# EAGLE design Infinity Camera (EAGLE 6.4)
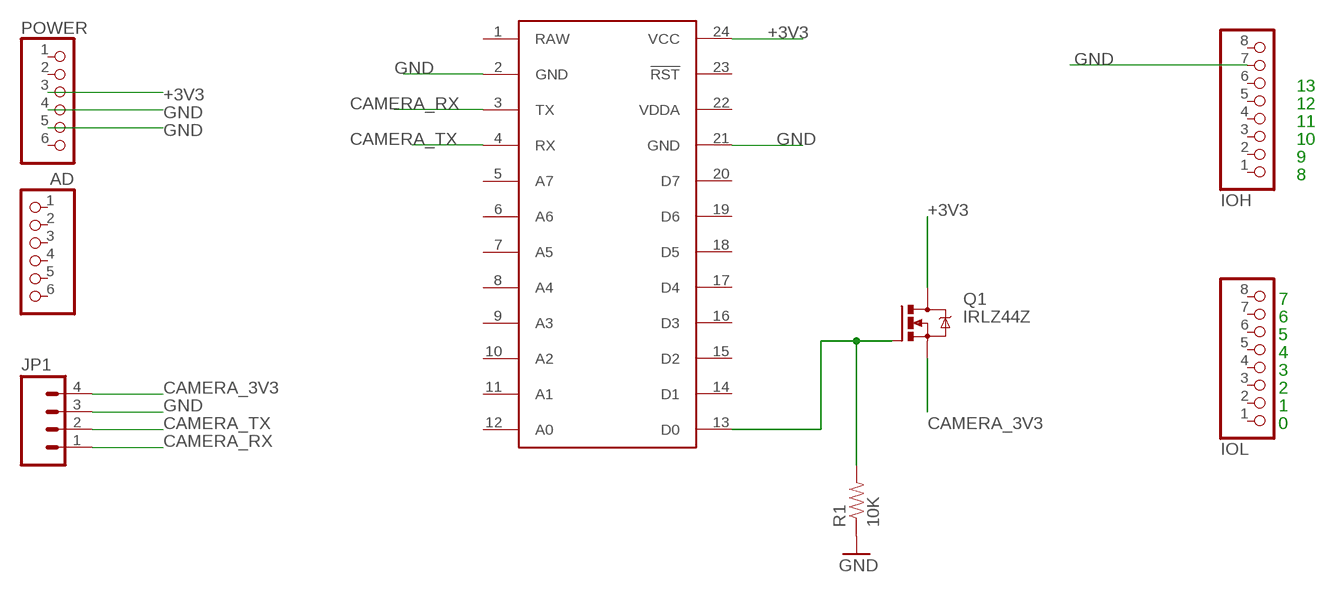
[diagram p0: schematic, sheet 1]

## Parts
AD  PINHD-1X6  [1X06]
IOH  PINHD-1X8  [1X08]
IOL  PINHD-1X8  [1X08]
JP1  M041.27MM  [1X04-1.27MM]
POWER  PINHD-1X6  [1X06]
Q1  IRLZ44Z  [TO220BH]
R1  10K  RESISTORPTH-1/4W  [AXIAL-0.4]
U$1  SPARK_CORECORE  [SPARK_CORE]

## Nets
+3V3: POWER.3 Q1.D U$1.24(VCC)
CAMERA_3V3: JP1.4 Q1.S
CAMERA_RX: JP1.1 U$1.3(TX)
CAMERA_TX: JP1.2 U$1.4(RX)
GND: IOH.7 JP1.3 POWER.4 POWER.5 R1.P$1 U$1.2(GND) U$1.21(GND)
N$1: Q1.G R1.P$2 U$1.13(D0)
Unconnected: AD.1 AD.2 AD.3 AD.4 AD.5 AD.6 IOH.1 IOH.2 IOH.3 IOH.4 IOH.5 IOH.6 IOH.8 IOL.1 IOL.2 IOL.3 IOL.4 IOL.5 IOL.6 IOL.7 IOL.8 POWER.1 POWER.2 POWER.6 U$1.5(A7) U$1.6(A6) U$1.7(A5) U$1.8(A4) U$1.9(A3) U$1.10(A2) U$1.11(A1) U$1.12(A0) U$1.14(D1) U$1.15(D2) U$1.16(D3) U$1.17(D4) U$1.18(D5) U$1.19(D6) U$1.20(D7) U$1.23(!RST)

## Notes on the sheet
- 13
- 12
- 11
- 10
- 9
- 8
- 7
- 6
- 5
- 4
- 3
- 2
- 1
- 0

## Power pins joined to a net without a drawn wire
RAW: U$1.1(RAW)
VDDA: U$1.22(VDDA)

## Library data of the parts
AD POWER = pinhead:PINHD-1X6: PIN HEADER
IOH IOL = pinhead:PINHD-1X8: PIN HEADER
JP1 = SparkFun-Connectors:M04: Header 4 Standard 4-pin 0.1" header. Use with straight break away headers (SKU : PRT-00116), right angle break away headers (PRT-00553), swiss pins (PRT-00743), machine pins (PRT-00117), and female headers (PRT-00115). Molex polarized connector foot print use with SKU : PRT-08231 with associated crimp pins and housings. 1MM SMD Version SKU: PRT-10208
Q1 = transistor-power:IRLZ44Z: N-Channel HEXFET® Power MOSFET Logic Level AUTOMOTIVE MOSFET Source: http://www.irf.com/product-info/datasheets/data/irlz44zpbf.pdf
R1 = SparkFun-Resistors:RESISTOR: Resistor Basic schematic elements and footprints for 0603, 1206, and PTH resistors.
U$1 = Spark:SPARK_CORE

## Net classes
0 default: width 0.152 mm, drill 0.305 mm, clearance 0.152 mm

## Board
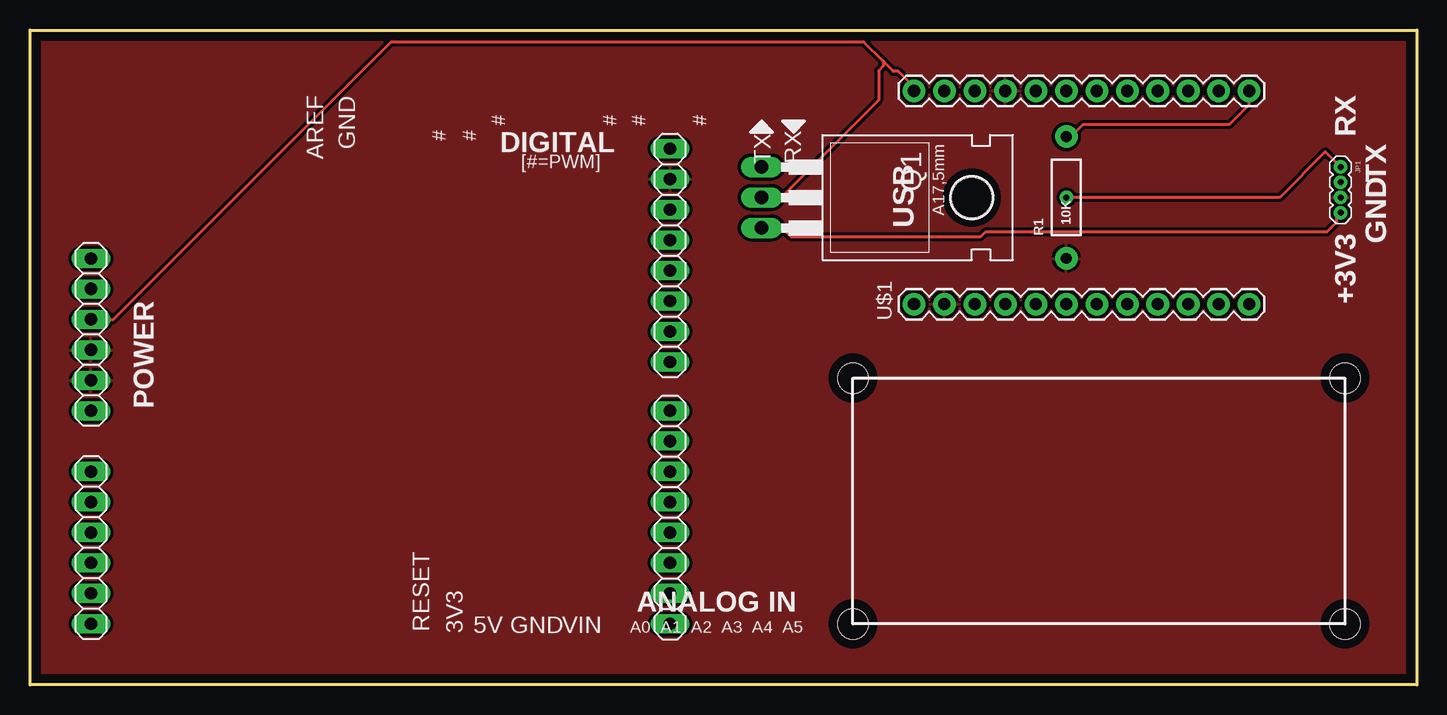
[diagram p1: board, top side]
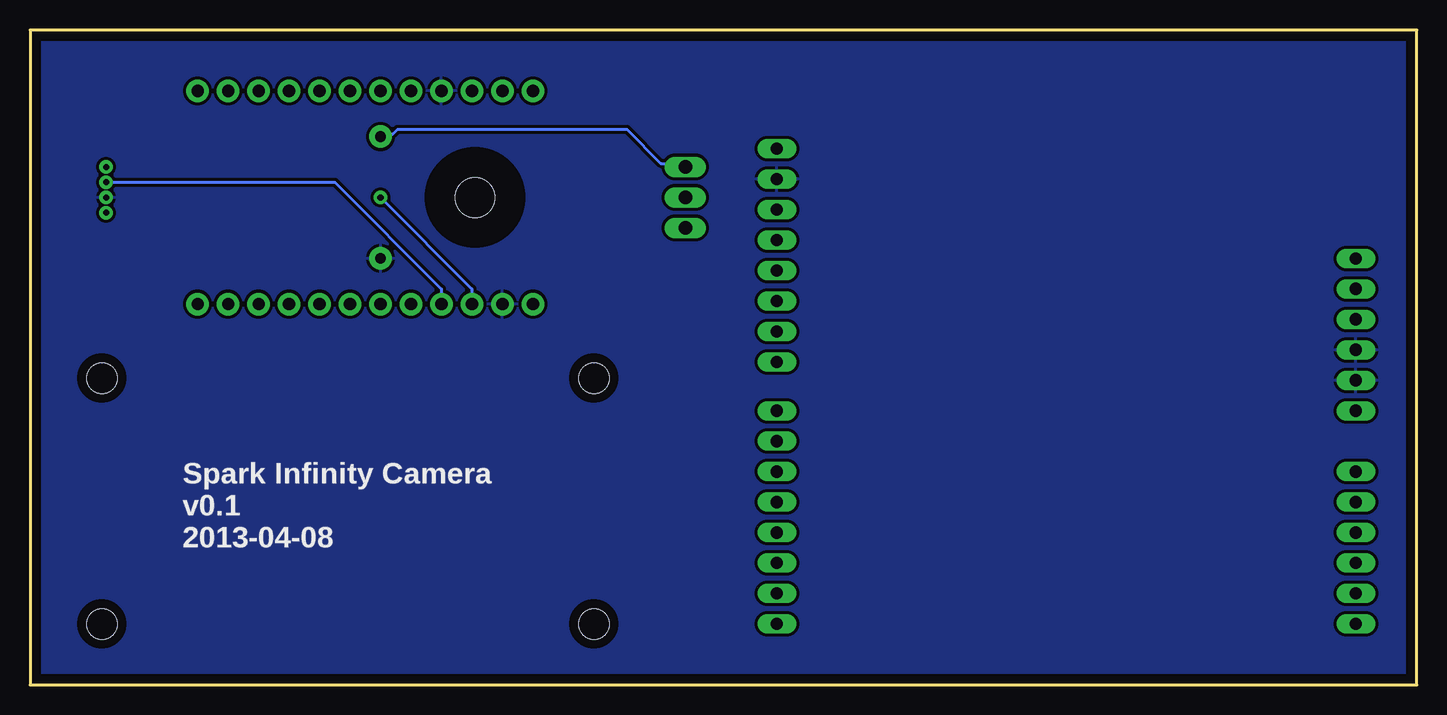
[diagram p2: board, bottom side, seen from below]

Size 115.57 x 54.61 mm. Coordinates in mm from the lower left corner, seen from the top.
Outline: 0,0 0,54.61 115.57,54.61 115.57,0 0,0
Copper layers (1*16): Top 0.035mm / dielectric 1.5mm / Bottom 0.035mm
Design rules "default *": minimum track width 10mil, minimum drill 12mil, track to track 10mil, track to pad 10mil, pad to pad 10mil, via to via 10mil, smd to smd 10mil, copper to edge 30mil, drill to drill 12mil, minimum pad ring 12mil, minimum via ring 12mil, stop-mask expansion 1mil, vias tented up to drill 0mil, thermal gap 10mil
Holes 2.54 mm at 109.58,5.08 68.58,5.08 68.58,25.58 109.58,25.58
vRestrict: area 47.9,10.3 to 48.5,10.8; area 50.4,10.2 to 50.9,11

### Footprints (pad centres in the part's own frame; a part is rotated, then mirrored left to right if it is on the bottom)
1X06 = drill 1.016 long: 1 -6.35,0; 2 -3.81,0; 3 -1.27,0; 4 1.27,0; 5 3.81,0; 6 6.35,0
1X08 = drill 1.016 long: 1 -8.89,0; 2 -6.35,0; 3 -3.81,0; 4 -1.27,0; 5 1.27,0; 6 3.81,0; 7 6.35,0; 8 8.89,0
1X04-1.27MM = drill 0.508 pad 1: 1 0,0; 2 1.27,0; 3 2.54,0; 4 3.81,0
TO220BH = drill 1.118 long: D 0,-6.35; G -2.54,-6.35; S 2.54,-6.35 | hole 3.302: 0,11.176
AXIAL-0.4 = drill 0.9 pad 1.88: P$1 -5.08,0; P$2 5.08,0
SPARK_CORE = drill 1.016 pad 1.88: 1 -8.89,13.97; 2 -8.89,11.43; 3 -8.89,8.89; 4 -8.89,6.35; 5 -8.89,3.81; 6 -8.89,1.27; 7 -8.89,-1.27; 8 -8.89,-3.81; 9 -8.89,-6.35; 10 -8.89,-8.89; 11 -8.89,-11.43; 12 -8.89,-13.97; 13 8.89,-13.97; 14 8.89,-11.43; 15 8.89,-8.89; 16 8.89,-6.35; 17 8.89,-3.81; 18 8.89,-1.27; 19 8.89,1.27; 20 8.89,3.81; 21 8.89,6.35; 22 8.89,8.89; 23 8.89,11.43; 24 8.89,13.97

### Placement (x,y rotation side)
AD  5.08,11.43 270 top
IOH  53.34,35.81 90 top
IOL  53.34,13.97 90 top
JP1  109.22,43.18 270 top
POWER  5.08,29.21 270 top
Q1  67.31,40.64 270 top
R1  86.36,40.64 90 top
U$1  87.63,40.64 90 top
U$2  [SPARK_LOGO]  7.62,5.08 0 top
U$3  [SPARK_LOGO]  74.93,38.1 0 top

### Tracks (layer width: path | path; a pad name or v marks a point on that pad's centre or on a via)
+3V3
  Top 0.254: 71.09,51.99 71.93,51.16 72.34,51.16 73.97,49.53 U$1.24 | 71.09,51.99 69.49,53.59 30.07,53.59 6.91,30.43 5.28,30.43 POWER.3 | Q1.D 62.59,40.64 70.71,48.77 70.71,51.21 71.12,51.61 71.12,52.02 71.09,51.99
CAMERA_3V3
  Top 0.254: JP1.4 108.92,39.01 108.92,38.61 108.1,37.8 79.65,37.8 79.25,37.39 63.4,37.39 62.59,38.2 60.96,38.2 Q1.S
CAMERA_RX  (via drill 0.51)
  Top 0.254: v86.36,40.64 104.14,40.64 107.95,44.45 JP1.1
  Bottom 0.254: U$1.3 78.74,33.02 v86.36,40.64
CAMERA_TX
  Bottom 0.254: U$1.4 81.28,33.02 90.17,41.91 JP1.2
GND
  pour Top: 0,0 0,54.61 115.57,54.61 115.57,0
  pour Bottom: 0,0 0,54.61 115.57,54.61 115.57,0
N$1
  Top 0.254: U$1.13 101.6,48.36 99.97,46.74 87.78,46.74 86.56,45.52 R1.P$2
  Bottom 0.254: Q1.G 60.96,43.48 62.99,43.48 65.84,46.33 84.94,46.33 85.34,45.92 86.16,45.92 R1.P$2

### Text on the board
tPlace: RX | TX | USB | GND | +3V3
bPlace: Spark Infinity Camera / v0.1 / 2013-04-08
tNames: AREF | GND | # | # | # | # | # | # | DIGITAL | [#=PWM] | TX | RX | ANALOG IN | RESET | 3V3 | 5V | GND | VIN | A0 | A1 | A2 | A3 | A4 | A5
214bmp: D:/SmartProjects/Snc/a4_bn_logo2.bmp